# EAGLE schematic HiveX-Schematic-09 (EAGLE 8.4.0)
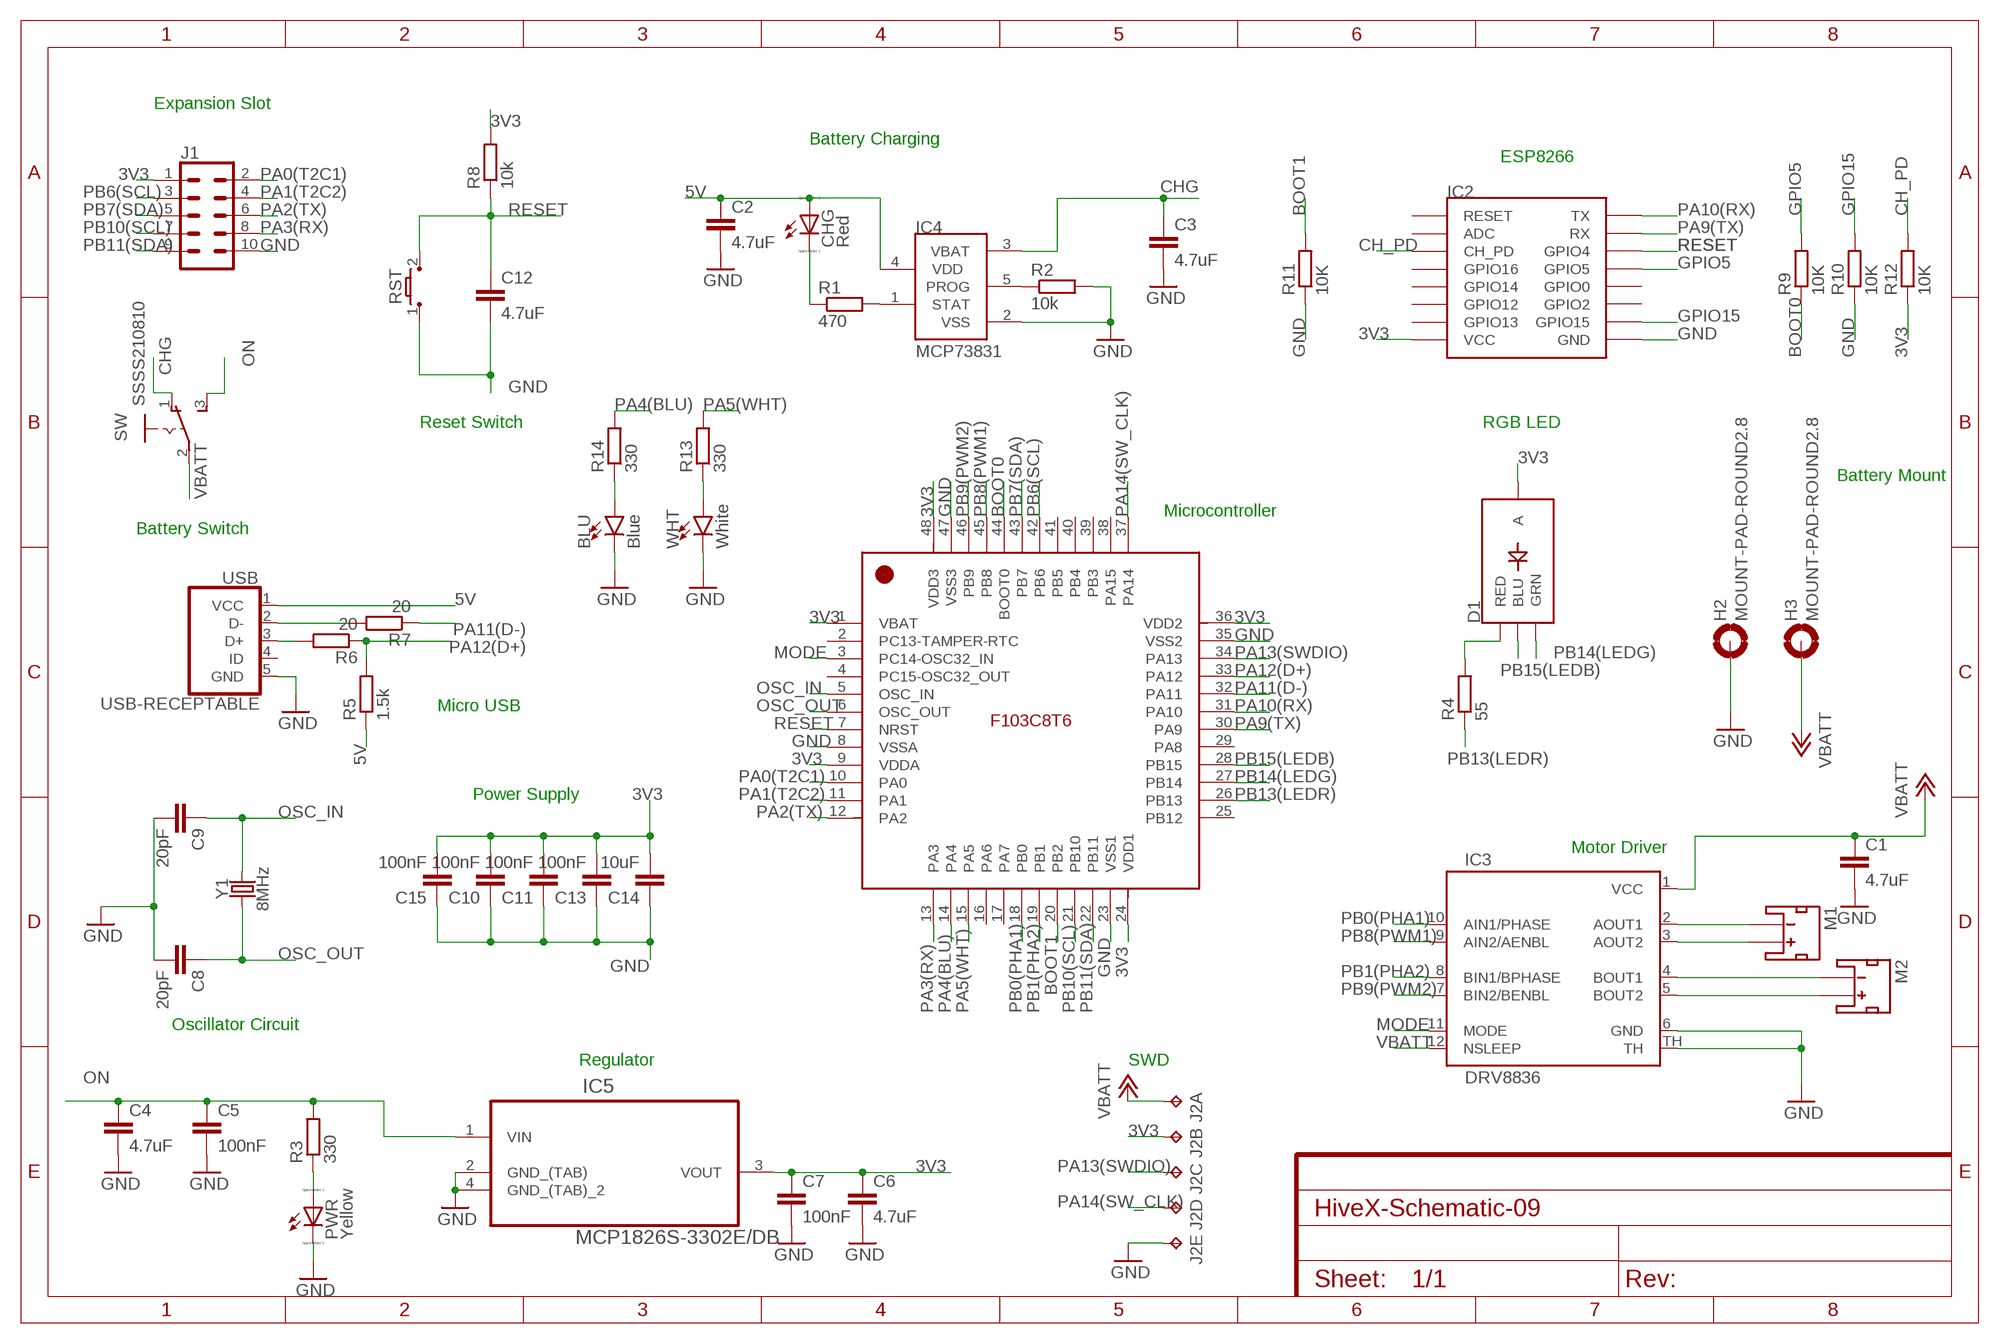
[diagram p0: schematic, sheet 1]
FRAME1 (FRAME-A4L): CNAME: HiveX Schematic; CREVISION: 0.9; DESIGNER: Aditya Bhat, Akshay Hegde

## Parts
BLU  Blue  LED-BLUE0603  [LED-0603]
C1  4.7uF  CAP0603-CAP  [0603-CAP]
C2  4.7uF  CAP0603-CAP  [0603-CAP]
C3  4.7uF  CAP0603-CAP  [0603-CAP]
C4  4.7uF  CAP0603-CAP  [0603-CAP]
C5  100nF  CAP0603-CAP  [0603-CAP]
C6  4.7uF  CAP0603-CAP  [0603-CAP]
C7  100nF  CAP0603-CAP  [0603-CAP]
C8  20pF  CAP0603-CAP  [0603-CAP]
C9  20pF  CAP0603-CAP  [0603-CAP]
C10  100nF  CAP0603-CAP  [0603-CAP]
C11  100nF  CAP0603-CAP  [0603-CAP]
C12  4.7uF  CAP0603-CAP  [0603-CAP]
C13  100nF  CAP0603-CAP  [0603-CAP]
C14  10uF  CAP0603-CAP  [0603-CAP]
C15  100nF  CAP0603-CAP  [0603-CAP]
CHG  Red  LED_ESML0603  [LED_SML0603]
D1  LED-RGB-CASMD  [LED-TRICOLOR-SMD]
H2  MOUNT-PAD-ROUND2.8  [2,8-PAD]
H3  MOUNT-PAD-ROUND2.8  [2,8-PAD]
IC1  STM32F103C8T6  [LQFP48_7X7MM_0.5MMPP]
IC2  ESP12  [ESP12]
IC3  DRV8836  [12WSON]
IC4  MCP73831  [SOT23-5L]
IC5  MCP1826S-3302E/DB  [SOT230P700X180-4N]
J1  CONN_05X2PTH  [2X5]
J2  TP5P5-25-13  [P5-25-13]
M1  JST_2MM_MALE  [JST-2-SMD]
M2  JST_2MM_MALE  [JST-2-SMD]
PWR  Yellow  LED_ESML0603  [LED_SML0603]
R1  470  R-EU_R0603  [R0603]
R2  10k  R-EU_R0603  [R0603]
R3  330  R-EU_R0603  [R0603]
R4  55  R-EU_R0603  [R0603]
R5  1.5k  R-EU_R0603  [R0603]
R6  20  R-EU_R0603  [R0603]
R7  20  R-EU_R0603  [R0603]
R8  10k  R-EU_R0603  [R0603]
R9  10K  R-EU_R0603  [R0603]
R10  10K  R-EU_R0603  [R0603]
R11  10K  R-EU_R0603  [R0603]
R12  10K  R-EU_R0603  [R0603]
R13  330  R-EU_R0603  [R0603]
R14  330  R-EU_R0603  [R0603]
RST  TL3302-J  [TL3303_J]
SW  SSSS210810  [SSSS210810]
USB  USB-RECEPTABLE  [FCI-10103594-0001LF]
WHT  White  LED-WHITE0603  [LED-0603]
Y1  8MHz  CRYSTAL-8MHZSMD-5X3.2  [CRYSTAL-SMD-5X3.2-4PAD]

## Nets
3V3: C6.1 C7.1 C10.2 C11.2 C13.2 C14.2 C15.2 D1.A IC1.1(VBAT) IC1.9(VDDA) IC1.24(VDD1) IC1.36(VDD2) IC1.48(VDD3) IC2.VCC IC5.3(VOUT) J1.1 J2.TP-2 R8.2 R12.1
5V: C2.1 CHG.A IC4.4(VDD) R5.1 USB.1(VCC)
BOOT0: IC1.44(BOOT0) R9.1
BOOT1: IC1.20(PB2) R11.2
CH_PD: IC2.CH_PD R12.2
CHG: C3.1 IC4.3(VBAT) SW.1(NC)
GND: BLU.C C1.2 C2.2 C3.2 C4.2 C5.2 C6.2 C7.2 C8.2 C9.2 C10.1 C11.1 C12.2 C13.1 C14.1 C15.1 H2.B2,8(MOUNT) IC1.8(VSSA) IC1.23(VSS1) IC1.35(VSS2) IC1.47(VSS3) IC2.GND IC3.6(GND) IC3.TH IC4.2(VSS) IC5.2(GND_(TAB)) IC5.4(GND_(TAB)_2) J1.10 J2.TP-5 PWR.C R2.2 R10.1 R11.1 RST.1 USB.5(GND) WHT.C
GPIO5: IC2.GPIO5 R9.2
GPIO15: IC2.GPIO15 R10.2
MODE: IC1.3(PC14-OSC32_IN) IC3.11(MODE)
N$2: IC3.3(AOUT2) M1.2(+)
N$3: IC3.4(BOUT1) M2.1(-)
N$4: IC3.2(AOUT1) M1.1(-)
N$5: IC3.5(BOUT2) M2.2(+)
N$6: D1.R(RED) R4.2
N$7: CHG.C R1.1
N$8: IC4.1(STAT) R1.2
N$9: IC4.5(PROG) R2.1
N$10: PWR.A R3.1
N$14: R6.2 USB.3(D+)
N$16: R7.2 USB.2(D-)
N$18: R13.1 WHT.A
N$19: BLU.A R14.1
ON: C4.1 C5.1 IC5.1(VIN) R3.2 SW.3(NO)
OSC_IN: C9.1 IC1.5(OSC_IN) Y1.3
OSC_OUT: C8.1 IC1.6(OSC_OUT) Y1.1
PA0(T2C1): IC1.10(PA0) J1.2
PA1(T2C2): IC1.11(PA1) J1.4
PA2(TX): IC1.12(PA2) J1.6
PA3(RX): IC1.13(PA3) J1.8
PA4(BLU): IC1.14(PA4) R14.2
PA5(WHT): IC1.15(PA5) R13.2
PA9(TX): IC1.30(PA9) IC2.RX
PA10(RX): IC1.31(PA10) IC2.TX
PA11(D-): IC1.32(PA11) R7.1
PA12(D+): IC1.33(PA12) R5.2 R6.1
PA13(SWDIO): IC1.34(PA13) J2.TP-3
PA14(SW_CLK): IC1.37(PA14) J2.TP-4
PB0(PHA1): IC1.18(PB0) IC3.10(AIN1/PHASE)
PB1(PHA2): IC1.19(PB1) IC3.8(BIN1/BPHASE)
PB6(SCL): IC1.42(PB6) J1.3
PB7(SDA): IC1.43(PB7) J1.5
PB8(PWM1): IC1.45(PB8) IC3.9(AIN2/AENBL)
PB9(PWM2): IC1.46(PB9) IC3.7(BIN2/BENBL)
PB10(SCL): IC1.21(PB10) J1.7
PB11(SDA): IC1.22(PB11) J1.9
PB13(LEDR): IC1.26(PB13) R4.1
PB14(LEDG): D1.G(GRN) IC1.27(PB14)
PB15(LEDB): D1.B(BLU) IC1.28(PB15)
RESET: C12.1 IC1.7(NRST) IC2.GPIO4 R8.1 RST.2
VBATT: C1.1 H3.B2,8(MOUNT) IC3.1(VCC) IC3.12(NSLEEP) J2.TP-1 SW.2(COM)
Unconnected: IC1.2(PC13-TAMPER-RTC) IC1.4(PC15-OSC32_OUT) IC1.16(PA6) IC1.17(PA7) IC1.25(PB12) IC1.29(PA8) IC1.38(PA15) IC1.39(PB3) IC1.40(PB4) IC1.41(PB5) IC2.ADC IC2.GPIO0 IC2.GPIO2 IC2.GPIO12 IC2.GPIO13 IC2.GPIO14 IC2.GPIO16 IC2.RESET M1.NC1(PAD1) M1.NC2(PAD2) M2.NC1(PAD1) M2.NC2(PAD2) USB.4(ID)

## Notes on the sheet
- Expansion Slot
- Battery Charging
- ESP8266
- Reset Switch | RGB LED
- Battery Mount
- Microcontroller
- Battery Switch
- Micro USB
- Power Supply
- Motor Driver
- Oscillator Circuit
- Regulator | SWD

## Library data of the parts
BLU = SparkFun-LED:LED-BLUE: Blue SMD LED Used in manufacturing of various products at SparkFun Packages: 0603 - SMD 0603 package [Product Link] <http://www.digikey.com/product-detail/en/SMLE12BC7TT86/511-1589-2-ND/1641808> 1206 - SMD1206 package [Product Link] <http://www.digikey.com/product-detail/en/lite-on-inc/LTST-C150TBKT/160-1643-1-ND/573584> SparkFun Products: ESP8266 Thing-Dev Board <https://www.sparkfun.com/products/13711> RedBoard <https://www.sparkfun.com/products/12757>; PROD_ID: DIO-08575; VALUE: BLUE
C1-C15 = SparkFun-Capacitors:CAP: Capacitor Standard 0603 ceramic capacitor, and 0.1" leaded capacitor.
CHG PWR = eagle-ltspice:LED_E: LED Source: http://www.osram.convergy.de Source: www.luxeon.com Source: www.kingbright.com; SPICEMODEL: NONE; SPICEPREFIX: D; SPICETYPE: diode
D1 = SparkFun-LED:LED-RGB-CA: LED-RGB Diffused Common Anode Packages: LED RGB-THRU P-LCC-4-3 LED-TRICOLOR-SMD SparkFun Products: RGB Diffused Common Anode- Diffuse <[https://www.sparkfun.com/products/10821]> RGB Diffused Common Anode - Clear <[https://www.sparkfun.com/products/10820]> Qduino Mini <[https://www.sparkfun.com/products/13614]> Triple Output LED RGB - SMD <https://www.sparkfun.com/products/7844>; PROD_ID: DIO-08324
H2 H3 = holes:MOUNT-PAD-ROUND: MOUNTING PAD, round
IC1 = STM32F103C8T6:STM32F103C8T6; AVAILABILITY: Good; DESCRIPTION: Mainstream Performance line%2C ARM Cortex-M3 MCU with 64 Kbytes Flash%2C 72 MHz CPU%2C motor control%2C USB and CAN; MF: STMicroelectronics; MP: STM32F103C8T6; PACKAGE: LQFP-48 STMicroelectronics; PRICE: 4.31 USD
IC2 = esp8266modules:ESP12: ESP8266 Wifi module 12
IC3 = balto:DRV8836: Dual low voltage H-Bridge IC
IC4 = mcp73831:MCP73831: Miniature Single-Cell, Fully Integrated Li-Ion, Li-Polymer Charge Management Controllers
IC5 = MCP1826S-3302E_DB:MCP1826S-3302E/DB: IC, LDO, 3.3V, 1A; AVAILABILITY: Good; DESCRIPTION: MCP1826S Series 1 A 3.3 V Fixed Output Surface Mount LDO Regulator - SOT-223; MF: Microchip; MP: MCP1826S-3302E/DB; PACKAGE: SOT-223-3 Microchip; PRICE: 0.62 USD
J1 = SparkFun-Connectors:CONN_05X2: Multi connection point. Often used as Generic Header-pin footprint for 0.1 inch spaced/style header connections For AVR SPI programming port, see special device with nice symbol: "AVR_SPI_PROG_5x2.dev" You can populate with any combo of single row headers, but if you'd like an exact match, check these: 2x5 AVR ICSP Male Header <https://www.sparkfun.com/products/778> (PRT-00778) 2x5 Pin Shrouded Header <https://www.sparkfun.com/products/8506> (PRT-08506) On any of the 0.1 inch spaced packages, you can populate with these: Break Away Headers - Straight <https://www.sparkfun.com/products/116> (PRT-00116) Break Away Male Headers - Right Angle <https://www.sparkfun.com/products/553> (PRT-00553) Female Headers <https://www.sparkfun.com/products/115> (PRT-00115) Break Away Headers - Machine Pin <https://www.sparkfun.com/products/117> (PRT-00117) Break Away Female Headers - Swiss Machine Pin <https://www.sparkfun.com/products/743> (PRT-00743) Special note: the shrouded connector mates well with our 5x2 ribbon cables: 2x5 Pin IDC Ribbon Cable <https://www.sparkfun.com/products/8535> (PRT-08535); PROD_ID: CONN-08499; SF_ID: PRT-0778
J2 = testpad:TP5: Test pad
M1 M2 = SparkFun-Connectors:JST_2MM_MALE: JST 2MM MALE RA CONNECTOR Two pin, compact surface mount connector. Commonly used as a battery input connection point. We really like the solid locking feeling and high current rating on these small connectors. We use these all the time as battery connectors. Mates to single-cell LiPo batteries. Here is the connector we sell at SparkFun: JST Right Angle Connector - White <https://www.sparkfun.com/products/8612> (PRT-08612) Datasheet <http://www.sparkfun.com/datasheets/Prototyping/Connectors/JST-Horizontal.pdf> It was used on these SparkFun products: SparkFun MOSFET Power Controller <https://www.sparkfun.com/products/11214> (PRT-11214) SparkFun Battery Babysitter - LiPo Battery Manager <https://www.sparkfun.com/products/13777> (PRT-13777) And many, many others that required a lipo battery connection.; PROD_ID: CONN-11443; SF_ID: PRT-08612
R1-R8 R13 R14 = resistor:R-EU_: RESISTOR, European symbol
R9-R12 = rcl:R-EU_: RESISTOR, European symbol
RST = eswitch-tact:TL3302: E-Switch TL3302 Series Tactile Switch Surface mount button commonly used for reset or general input. 3.5 x 6mm packaged design. -G: Gull wing termination. Parts TL-3302-x-xxxx-x-G -J: J-Lead termination. Parts TL-3302-x-xxxx-x-J Source: http://www.e-switch.com/Portals/0/Series_Pdf/TL3302.pdf Supplier: DigiKey: http://be.digikey.com/scripts/dksearch/dksus.dll?vendor=0&keywords=TL3302
SW = formica:SSSS210810
USB = daspilker:USB-RECEPTABLE: USB Receptable
WHT = SparkFun-LED:LED-WHITE: White SMD LED Used in manufacturing several products at SparkFun. Packages: 0603 - Bright White SMD 0603 package[Product Link] <http://www.kingbrightusa.com/product.asp?catalog_name=LED&product_id=APT1608QWF/D> 1206 - Bright White SMD1206 package [Product Link] <http://www.kingbrightusa.com/product.asp?catalog_name=LED&product_id=APT3216QWF/D> 3014 - Super Bright SMD 3014 package [Datasheet] <http://www.lumileds.com/uploads/459/DS208-pdf> SparkFun Products: Blackberry Trackballer Breakout <https://www.sparkfun.com/products/13169> Digital SandBox <https://www.sparkfun.com/products/12651>; PROD_ID: DIO-09004; VALUE: WHITE
Y1 = SparkFun-Clocks:CRYSTAL-8MHZ: 8MHz Crystal Datasheet Example <http://www.futureelectronics.com/en/technologies/electromechanical/timing-devices/crystals/Pages/6008189-ABM3B-8.000MHZ-B2-T.aspx?IM=0> Frequency: 8MHz Frequency Tolerance: ±20ppm Load Capacitance: 18pF SparkFun Products: Pro Micro -3.3V/8MHz <https://www.sparkfun.com/products/12587> WAV Trigger <https://www.sparkfun.com/products/13660>; PROD_ID: XTAL-09431